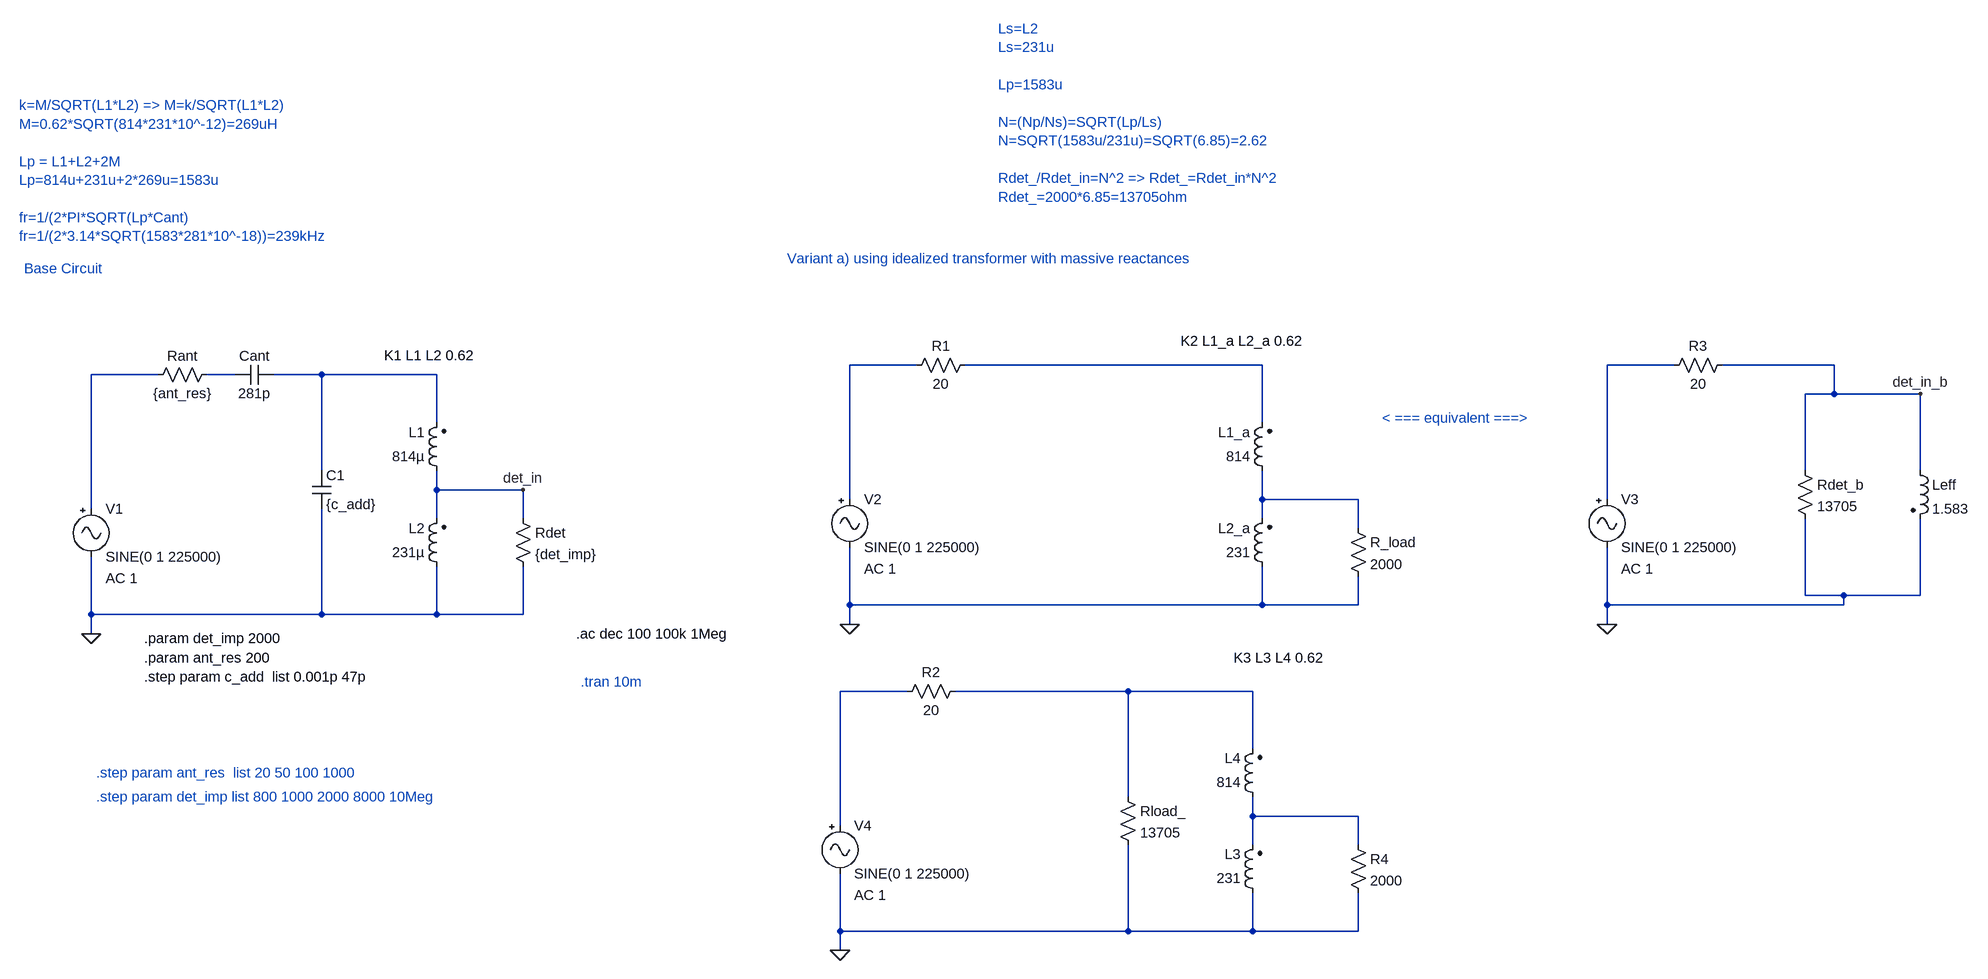
[diagram p0: schematic Detector_Radio_Filter_Tapped_final.asc]
Detector_Radio_Filter_Tapped_final.asc, the LTspice schematic file:
Version 4
SHEET 1 1648 980
WIRE -320 -160 -432 -160
WIRE 256 -160 -240 -160
WIRE 944 -160 832 -160
WIRE 1392 -160 1024 -160
WIRE -1584 -144 -1696 -144
WIRE -1456 -144 -1504 -144
WIRE -1312 -144 -1392 -144
WIRE -1120 -144 -1312 -144
WIRE 1392 -112 1392 -160
WIRE 1392 -112 1344 -112
WIRE 1536 -112 1392 -112
WIRE -1120 -64 -1120 -144
WIRE 256 -64 256 -160
WIRE -1312 16 -1312 -144
WIRE 1344 16 1344 -112
WIRE 1536 16 1536 -112
WIRE -1120 48 -1120 16
WIRE -976 48 -1120 48
WIRE -432 64 -432 -160
WIRE 256 64 256 16
WIRE 416 64 256 64
WIRE 832 64 832 -160
WIRE -1696 80 -1696 -144
WIRE -1120 96 -1120 48
WIRE -976 96 -976 48
WIRE 256 96 256 64
WIRE 416 112 416 64
WIRE 1344 224 1344 96
WIRE 1408 224 1344 224
WIRE 1536 224 1536 96
WIRE 1536 224 1408 224
WIRE -432 240 -432 144
WIRE 256 240 256 176
WIRE 256 240 -432 240
WIRE 416 240 416 192
WIRE 416 240 256 240
WIRE 832 240 832 144
WIRE 1408 240 1408 224
WIRE 1408 240 832 240
WIRE -1696 256 -1696 160
WIRE -1312 256 -1312 80
WIRE -1312 256 -1696 256
WIRE -1120 256 -1120 176
WIRE -1120 256 -1312 256
WIRE -976 256 -976 176
WIRE -976 256 -1120 256
WIRE -432 272 -432 240
WIRE 832 272 832 240
WIRE -1696 288 -1696 256
WIRE -336 384 -448 384
WIRE 32 384 -256 384
WIRE 240 384 32 384
WIRE 240 480 240 384
WIRE 32 560 32 384
WIRE 240 592 240 560
WIRE 416 592 240 592
WIRE -448 608 -448 384
WIRE 240 640 240 592
WIRE 416 640 416 592
WIRE -448 784 -448 688
WIRE 32 784 32 640
WIRE 32 784 -448 784
WIRE 240 784 240 720
WIRE 240 784 32 784
WIRE 416 784 416 720
WIRE 416 784 240 784
WIRE -448 816 -448 784
FLAG -1696 288 0
FLAG -976 48 det_in
FLAG -432 272 0
FLAG 832 272 0
FLAG 1536 -112 det_in_b
FLAG -448 816 0
SYMBOL ind2 -1104 192 R180
WINDOW 0 36 80 Left 2
WINDOW 3 36 40 Left 2
SYMATTR InstName L2
SYMATTR Value 231µ
SYMATTR Type ind
SYMBOL Misc\\signal -1696 64 R0
WINDOW 123 24 132 Left 2
WINDOW 39 0 0 Left 0
SYMATTR Value2 AC 1
SYMATTR InstName V1
SYMATTR Value SINE(0 1 225000)
SYMBOL ind2 -1104 32 R180
WINDOW 0 36 80 Left 2
WINDOW 3 36 40 Left 2
SYMATTR InstName L1
SYMATTR Value 814µ
SYMATTR Type ind
SYMBOL res -1488 -160 R90
WINDOW 0 0 56 VBottom 2
WINDOW 3 32 56 VTop 2
SYMATTR InstName Rant
SYMATTR Value {ant_res}
SYMBOL cap -1392 -160 R90
WINDOW 0 0 32 VBottom 2
WINDOW 3 32 32 VTop 2
SYMATTR InstName Cant
SYMATTR Value 281p
SYMBOL res -992 80 R0
SYMATTR InstName Rdet
SYMATTR Value {det_imp}
SYMBOL ind2 272 192 R180
WINDOW 0 36 80 Left 2
WINDOW 3 36 40 Left 2
SYMATTR InstName L2_a
SYMATTR Value 231
SYMATTR Type ind
SYMBOL Misc\\signal -432 48 R0
WINDOW 123 24 132 Left 2
WINDOW 39 0 0 Left 0
SYMATTR Value2 AC 1
SYMATTR InstName V2
SYMATTR Value SINE(0 1 225000)
SYMBOL ind2 272 32 R180
WINDOW 0 36 80 Left 2
WINDOW 3 36 40 Left 2
SYMATTR InstName L1_a
SYMATTR Value 814
SYMATTR Type ind
SYMBOL res -224 -176 R90
WINDOW 0 0 56 VBottom 2
WINDOW 3 32 56 VTop 2
SYMATTR InstName R1
SYMATTR Value 20
SYMBOL Misc\\signal 832 48 R0
WINDOW 123 24 132 Left 2
WINDOW 39 0 0 Left 0
SYMATTR Value2 AC 1
SYMATTR InstName V3
SYMATTR Value SINE(0 1 225000)
SYMBOL res 1040 -176 R90
WINDOW 0 0 56 VBottom 2
WINDOW 3 32 56 VTop 2
SYMATTR InstName R3
SYMATTR Value 20
SYMBOL res 1328 0 R0
SYMATTR InstName Rdet_b
SYMATTR Value 13705
SYMBOL ind2 1520 0 R0
SYMATTR InstName Leff
SYMATTR Value 1.583
SYMATTR Type ind
SYMBOL ind2 256 736 R180
WINDOW 0 36 80 Left 2
WINDOW 3 36 40 Left 2
SYMATTR InstName L3
SYMATTR Value 231
SYMATTR Type ind
SYMBOL Misc\\signal -448 592 R0
WINDOW 123 24 132 Left 2
WINDOW 39 0 0 Left 0
SYMATTR Value2 AC 1
SYMATTR InstName V4
SYMATTR Value SINE(0 1 225000)
SYMBOL ind2 256 576 R180
WINDOW 0 36 80 Left 2
WINDOW 3 36 40 Left 2
SYMATTR InstName L4
SYMATTR Value 814
SYMATTR Type ind
SYMBOL res -240 368 R90
WINDOW 0 0 56 VBottom 2
WINDOW 3 32 56 VTop 2
SYMATTR InstName R2
SYMATTR Value 20
SYMBOL res 16 544 R0
SYMATTR InstName Rload_
SYMATTR Value 13705
SYMBOL res 400 96 R0
SYMATTR InstName R_load
SYMATTR Value 2000
SYMBOL res 400 624 R0
SYMATTR InstName R4
SYMATTR Value 2000
SYMBOL cap -1328 16 R0
SYMATTR InstName C1
SYMATTR Value {c_add}
TEXT -888 288 Left 2 !.ac dec 100 100k 1Meg
TEXT -880 368 Left 2 ;.tran 10m
TEXT -1208 -176 Left 2 !K1 L1 L2 0.62
TEXT -1688 560 Left 2 ;.step param det_imp list 800 1000 2000 8000 10Meg
TEXT 120 -200 Left 2 !K2 L1_a L2_a 0.62
TEXT -1608 296 Left 2 !.param det_imp 2000
TEXT -1808 -368 Left 2 ;Base Circuit
TEXT -536 -384 Left 2 ;Variant a) using idealized transformer with massive reactances
TEXT 456 -72 Left 2 ;< === equivalent ===>
TEXT -1816 -640 Left 2 ;k=M/SQRT(L1*L2) => M=k/SQRT(L1*L2)\nM=0.62*SQRT(814*231*10^-12)=269uH\n \nLp = L1+L2+2M\nLp=814u+231u+2*269u=1583u\n \nfr=1/(2*PI*SQRT(Lp*Cant)\nfr=1/(2*3.14*SQRT(1583*281*10^-18))=239kHz
TEXT -184 -768 Left 2 ;Ls=L2\nLs=231u\n \nLp=1583u\n \nN=(Np/Ns)=SQRT(Lp/Ls)\nN=SQRT(1583u/231u)=SQRT(6.85)=2.62\n \nRdet_/Rdet_in=N^2 => Rdet_=Rdet_in*N^2\nRdet_=2000*6.85=13705ohm
TEXT 208 328 Left 2 !K3 L3 L4 0.62
TEXT -1688 520 Left 2 ;.step param ant_res  list 20 50 100 1000
TEXT -1608 328 Left 2 !.param ant_res 200
TEXT -1608 360 Left 2 !.step param c_add  list 0.001p 47p

The netlist it stands for:
* Detector_Radio_Filter_Tapped_final.asc
L2 0 det_in 231µ
V1 N004 0 SINE(0 1 225000) AC 1
L1 det_in N006 814µ
Rant N005 N004 {ant_res}
Cant N006 N005 281p
Rdet det_in 0 {det_imp}
L2_a 0 N007 231
V2 N001 0 SINE(0 1 225000) AC 1
L1_a N007 N002 814
R1 N002 N001 20
V3 N003 0 SINE(0 1 225000) AC 1
R3 det_in_b N003 20
Rdet_b det_in_b 0 13705
Leff det_in_b 0 1.583
L3 0 N010 231
V4 N008 0 SINE(0 1 225000) AC 1
L4 N010 N009 814
R2 N009 N008 20
Rload_ N009 0 13705
R_load N007 0 2000
R4 N010 0 2000
C1 N006 0 {c_add}
.ac dec 100 100k 1Meg
* .tran 10m
K1 L1 L2 0.62
* .step param det_imp list 800 1000 2000 8000 10Meg
K2 L1_a L2_a 0.62
.param det_imp 2000
* Base Circuit
* Variant a) using idealized transformer with massive reactances
* < === equivalent ===>
* k=M/SQRT(L1*L2) => M=k/SQRT(L1*L2)
* M=0.62*SQRT(814*231*10^-12)=269uH
* Lp = L1+L2+2M
* Lp=814u+231u+2*269u=1583u
* fr=1/(2*PI*SQRT(Lp*Cant)
* fr=1/(2*3.14*SQRT(1583*281*10^-18))=239kHz
* Ls=L2
* Ls=231u
* Lp=1583u
* N=(Np/Ns)=SQRT(Lp/Ls)
* N=SQRT(1583u/231u)=SQRT(6.85)=2.62
* Rdet_/Rdet_in=N^2 => Rdet_=Rdet_in*N^2
* Rdet_=2000*6.85=13705ohm
K3 L3 L4 0.62
* .step param ant_res  list 20 50 100 1000
.param ant_res 200
.step param c_add  list 0.001p 47p
.backanno
.end